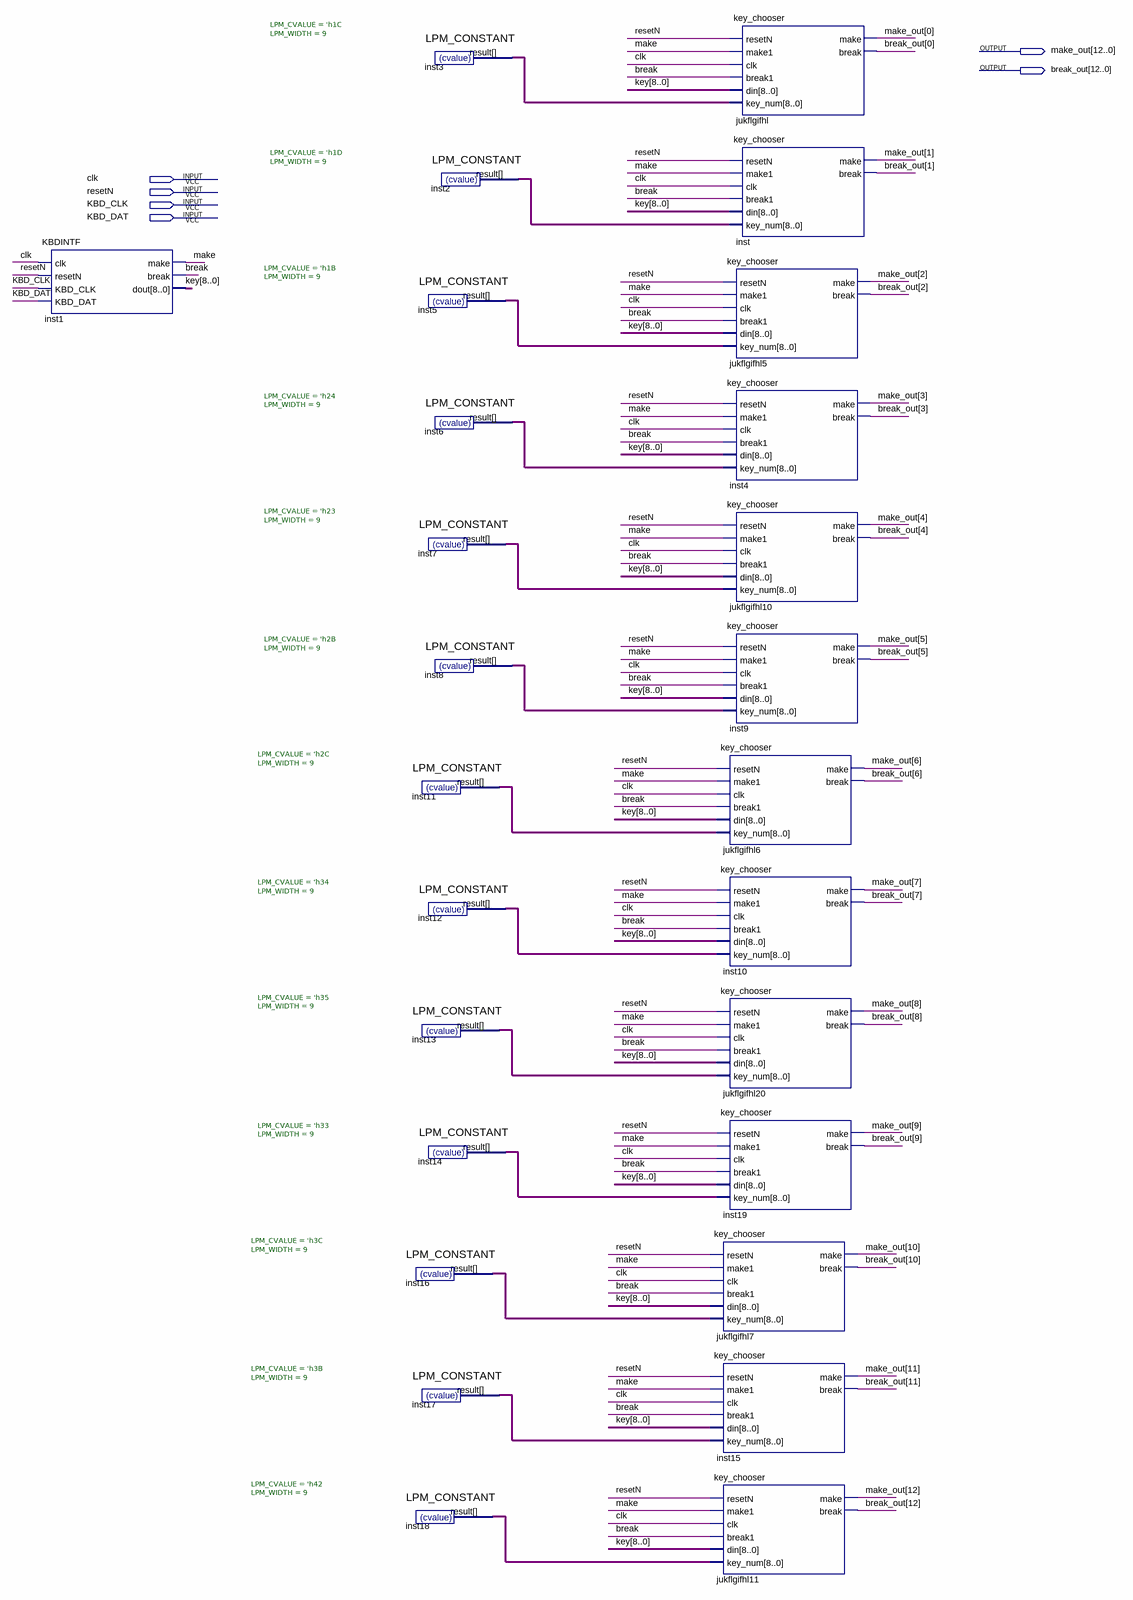
[diagram p0: schematic sheet]
// Quartus schematic keyboard_module_diag.bdf as structural Verilog: 27 symbols, 6 pins
module keyboard_module_diag (
  input  clk,
  input  resetN,
  input  KBD_CLK,
  input  KBD_DAT,
  output [12:0] make_out,
  output [12:0] break_out
);

  wire \break , make;
  wire [8:0] inst2_result, inst3_result, inst5_result, inst6_result, inst7_result, inst8_result,
       inst11_result, inst12_result, inst13_result, inst14_result, inst16_result, inst17_result,
       inst18_result, key;

  KBDINTF inst1 (
    .clk(clk), .resetN(resetN), .KBD_CLK(KBD_CLK), .KBD_DAT(KBD_DAT), .make(make), .\break (\break ),
    .dout(key));
  LPM_CONSTANT #(.LPM_CVALUE('h1C), .LPM_WIDTH(9)) inst3 (.result(inst3_result));
  LPM_CONSTANT #(.LPM_CVALUE('h1D), .LPM_WIDTH(9)) inst2 (.result(inst2_result));
  LPM_CONSTANT #(.LPM_CVALUE('h1B), .LPM_WIDTH(9)) inst5 (.result(inst5_result));
  LPM_CONSTANT #(.LPM_CVALUE('h24), .LPM_WIDTH(9)) inst6 (.result(inst6_result));
  LPM_CONSTANT #(.LPM_CVALUE('h23), .LPM_WIDTH(9)) inst7 (.result(inst7_result));
  LPM_CONSTANT #(.LPM_CVALUE('h2B), .LPM_WIDTH(9)) inst8 (.result(inst8_result));
  LPM_CONSTANT #(.LPM_CVALUE('h2C), .LPM_WIDTH(9)) inst11 (.result(inst11_result));
  LPM_CONSTANT #(.LPM_CVALUE('h34), .LPM_WIDTH(9)) inst12 (.result(inst12_result));
  LPM_CONSTANT #(.LPM_CVALUE('h35), .LPM_WIDTH(9)) inst13 (.result(inst13_result));
  LPM_CONSTANT #(.LPM_CVALUE('h33), .LPM_WIDTH(9)) inst14 (.result(inst14_result));
  LPM_CONSTANT #(.LPM_CVALUE('h3C), .LPM_WIDTH(9)) inst16 (.result(inst16_result));
  LPM_CONSTANT #(.LPM_CVALUE('h3B), .LPM_WIDTH(9)) inst17 (.result(inst17_result));
  LPM_CONSTANT #(.LPM_CVALUE('h42), .LPM_WIDTH(9)) inst18 (.result(inst18_result));
  key_chooser jukflgifhl (
    .resetN(resetN), .make1(make), .clk(clk), .break1(\break ), .din(key), .key_num(inst3_result),
    .make(make_out[0]), .\break (break_out[0]));
  key_chooser inst (
    .resetN(resetN), .make1(make), .clk(clk), .break1(\break ), .din(key), .key_num(inst2_result),
    .make(make_out[1]), .\break (break_out[1]));
  key_chooser jukflgifhl5 (
    .resetN(resetN), .make1(make), .clk(clk), .break1(\break ), .din(key), .key_num(inst5_result),
    .make(make_out[2]), .\break (break_out[2]));
  key_chooser inst4 (
    .resetN(resetN), .make1(make), .clk(clk), .break1(\break ), .din(key), .key_num(inst6_result),
    .make(make_out[3]), .\break (break_out[3]));
  key_chooser jukflgifhl10 (
    .resetN(resetN), .make1(make), .clk(clk), .break1(\break ), .din(key), .key_num(inst7_result),
    .make(make_out[4]), .\break (break_out[4]));
  key_chooser inst9 (
    .resetN(resetN), .make1(make), .clk(clk), .break1(\break ), .din(key), .key_num(inst8_result),
    .make(make_out[5]), .\break (break_out[5]));
  key_chooser jukflgifhl6 (
    .resetN(resetN), .make1(make), .clk(clk), .break1(\break ), .din(key), .key_num(inst11_result),
    .make(make_out[6]), .\break (break_out[6]));
  key_chooser inst10 (
    .resetN(resetN), .make1(make), .clk(clk), .break1(\break ), .din(key), .key_num(inst12_result),
    .make(make_out[7]), .\break (break_out[7]));
  key_chooser jukflgifhl20 (
    .resetN(resetN), .make1(make), .clk(clk), .break1(\break ), .din(key), .key_num(inst13_result),
    .make(make_out[8]), .\break (break_out[8]));
  key_chooser inst19 (
    .resetN(resetN), .make1(make), .clk(clk), .break1(\break ), .din(key), .key_num(inst14_result),
    .make(make_out[9]), .\break (break_out[9]));
  key_chooser jukflgifhl7 (
    .resetN(resetN), .make1(make), .clk(clk), .break1(\break ), .din(key), .key_num(inst16_result),
    .make(make_out[10]), .\break (break_out[10]));
  key_chooser inst15 (
    .resetN(resetN), .make1(make), .clk(clk), .break1(\break ), .din(key), .key_num(inst17_result),
    .make(make_out[11]), .\break (break_out[11]));
  key_chooser jukflgifhl11 (
    .resetN(resetN), .make1(make), .clk(clk), .break1(\break ), .din(key), .key_num(inst18_result),
    .make(make_out[12]), .\break (break_out[12]));
endmodule
